# Altium schematic sheet US_SB_MCU.SchDoc
size A2
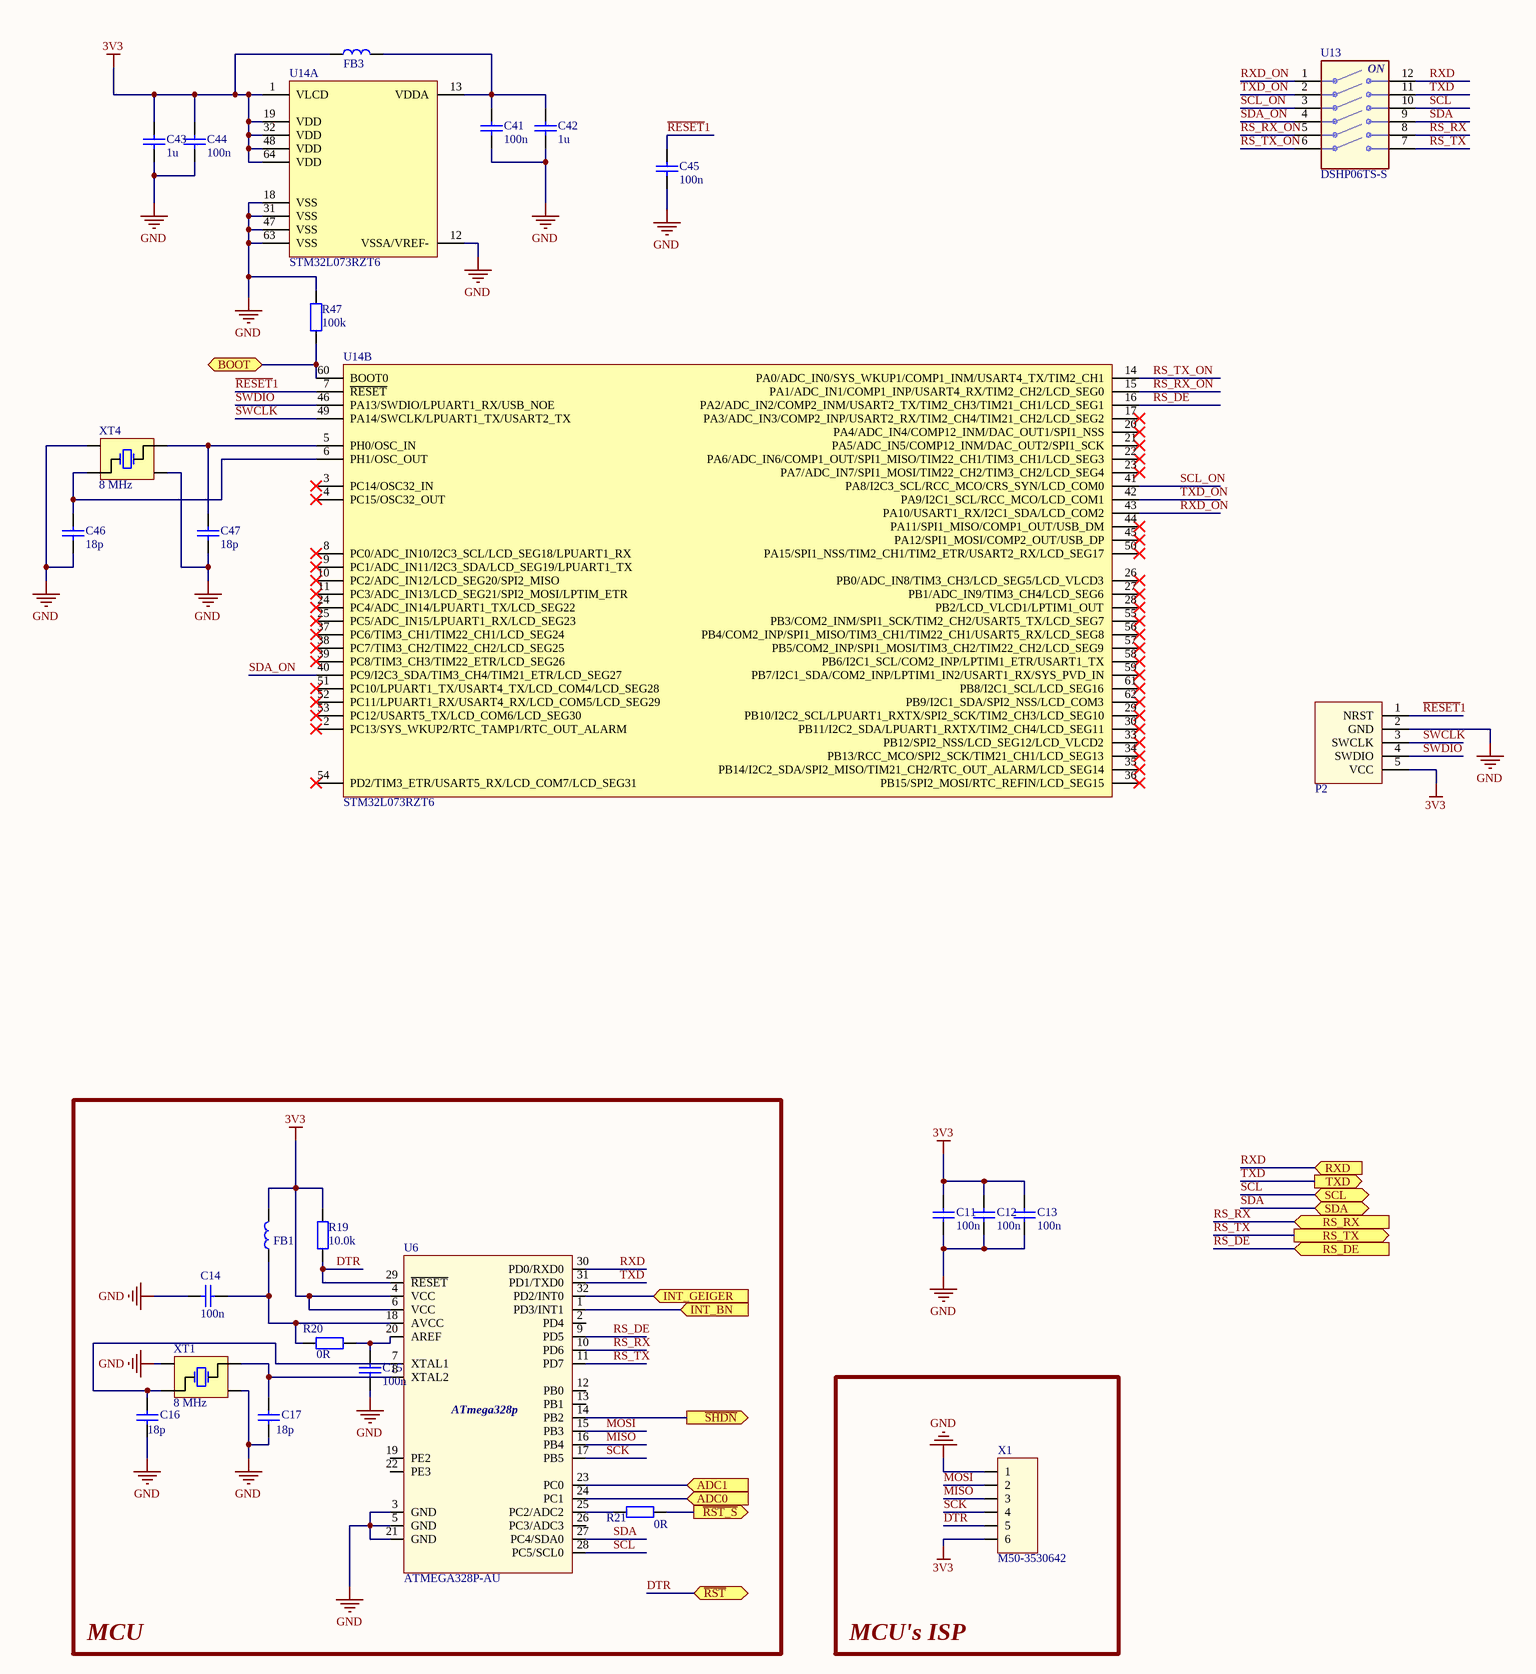
[diagram p0: US_SB_MCU.SchDoc]

## Parts
C11  100n  [C0603_IPC_HD]
C12  100n  [C0603_IPC_HD]
C13  100n  [C0603_IPC_HD]
C14  100n  [C0603_IPC_HD]
C15  100n  [C0603_IPC_HD]
C16  18p  [C0603_IPC_HD]
C17  18p  [C0603_IPC_HD]
C41  100n  [C0603_IPC_HD]
C42  1u  [C0603_IPC_HD]
C43  1u  [C0603_IPC_HD]
C44  100n  [C0603_IPC_HD]
C45  100n  [C0603_IPC_HD]
C46  18p  [C0603_IPC_HD]
C47  18p  [C0603_IPC_HD]
FB1  MH1608-601Y  [L0603_IPC_MD]  (value not drawn)
FB3  MH1608-601Y  [L0603_IPC_MD]  (value not drawn)
P2  SWD  [SWD_CON_VAR1]  (value not drawn)  (no BOM)
R19  10.0k  [R0603_IPC_MD]
R20  0R  [R0603_IPC_MD]
R21  0R  [R0603_IPC_MD]  (no BOM)
R47  100k  [R0603_IPC_MD]
U6  ATMEGA328P-AU  [ATmega328P_TQFP80P900X900X120-32N]
U13  DSHP06TS-S  [SOIC_SW_SOIC127P850X235-12N]
U14  STM32L073RZT6  [LQFP64_10X10MM]  (parts A,B of 2)
X1  M50-3530642  [PLS_1X6_1.27]  (no BOM)
XT1  8 MHz  [5.0X3.2_4PAD_SMT]
XT4  8 MHz  [5.0X3.2_4PAD_SMT]

## Blocks framed on the sheet
MCU: C14-C17 FB1 R19-R21 U6 XT1
MCU's ISP: X1

## Ports
ADC0 (in), ADC1 (in), BOOT, INT_BN (in), INT_GEIGER (in), RS_DE (in), RS_RX (in), RS_TX (out), RXD (in), SCL, SDA, TXD (out), ~{RST_S} (out), ~{RST}, ~{SHDN} (out)

## Nets
3V3: C11.1 C12.1 C13.1 C43.2 C44.2 FB1.2 FB3.1 P2.5(VCC) R19.2 U6.4(VCC) U6.6(VCC) U14.1(VLCD) U14.19(VDD) U14.32(VDD) U14.48(VDD) U14.64(VDD) X1.6
GND: C11.2 C12.2 C13.2 C14.2 C15.2 C16.1 C17.1 C41.1 C42.1 C43.1 C44.1 C45.2 C46.1 C47.1 P2.2(GND) R47.2 U6.3(GND) U6.5(GND) U6.21(GND) U14.12(VSSA/VREF-) U14.18(VSS) U14.31(VSS) U14.47(VSS) U14.63(VSS) X1.1 XT1.2(NC) XT1.4(NC) XT4.2(NC) XT4.4(NC)
~{RESET}1: C45.1 P2.1(NRST) U14.7(~{RESET})
~{RST_S}: R21.2 ; port ~{RST_S}
~{SHDN}: U6.14(PB2) ; port ~{SHDN}
ADC0: U6.24(PC1) ; port ADC0
ADC1: U6.23(PC0) ; port ADC1
BOOT: R47.1 U14.60(BOOT0) ; port BOOT
DTR: R19.1 U6.29(~{RESET}) X1.5 ; port ~{RST}
INT_BN: U6.1(PD3/INT1) ; port INT_BN
INT_GEIGER: U6.32(PD2/INT0) ; port INT_GEIGER
MISO: U6.16(PB4) X1.3
MOSI: U6.15(PB3) X1.2
RS_DE: U6.9(PD5) U14.16(PA2/ADC_IN2/COMP2_INM/USART2_TX/TIM2_CH3/TIM21_CH1/LCD_SEG1) ; port RS_DE
RS_RX: U6.10(PD6) U13.8 ; port RS_RX
RS_RX_ON: U13.5 U14.15(PA1/ADC_IN1/COMP1_INP/USART4_RX/TIM2_CH2/LCD_SEG0)
RS_TX: U6.11(PD7) U13.7 ; port RS_TX
RS_TX_ON: U13.6 U14.14(PA0/ADC_IN0/SYS_WKUP1/COMP1_INM/USART4_TX/TIM2_CH1)
RXD: U6.30(PD0/RXD0) U13.12 ; port RXD
RXD_ON: U13.1 U14.43(PA10/USART1_RX/I2C1_SDA/LCD_COM2)
SCK: U6.17(PB5) X1.4
SCL: U6.28(PC5/SCL0) U13.10 ; port SCL
SCL_ON: U13.3 U14.41(PA8/I2C3_SCL/RCC_MCO/CRS_SYN/LCD_COM0)
SDA: U6.27(PC4/SDA0) U13.9 ; port SDA
SDA_ON: U13.4 U14.40(PC9/I2C3_SDA/TIM3_CH4/TIM21_ETR/LCD_SEG27)
SWCLK: P2.3(SWCLK) U14.49(PA14/SWCLK/LPUART1_TX/USART2_TX)
SWDIO: P2.4(SWDIO) U14.46(PA13/SWDIO/LPUART1_RX/USB_NOE)
TXD: U6.31(PD1/TXD0) U13.11 ; port TXD
TXD_ON: U13.2 U14.42(PA9/I2C1_SCL/RCC_MCO/LCD_COM1)
NetC14_1: C14.1 FB1.1 R20.1 U6.18(AVCC)
NetC15_1: C15.1 R20.2 U6.20(AREF)
NetC16_2: C16.2 U6.7(XTAL1) XT1.3(OSC2)
NetC17_2: C17.2 U6.8(XTAL2) XT1.1(OSC1)
NetC41_2: C41.2 C42.2 FB3.2 U14.13(VDDA)
NetC46_2: C46.2 U14.6(PH1/OSC_OUT) XT4.3(OSC2)
NetC47_2: C47.2 U14.5(PH0/OSC_IN) XT4.1(OSC1)
NetR21_1: R21.1 U6.25(PC2/ADC2)

Not connected (* = marked no-connect by the designer): U6 2(PD4) 12(PB0) 13(PB1) 19(PE2) 22(PE3) 26(PC3/ADC3); U14 2(PC13/SYS_WKUP2/RTC_TAMP1/RTC_OUT_ALARM)* 3(PC14/OSC32_IN)* 4(PC15/OSC32_OUT)* 8(PC0/ADC_IN10/I2C3_SCL/LCD_SEG18/LPUART1_RX)* 9(PC1/ADC_IN11/I2C3_SDA/LCD_SEG19/LPUART1_TX)* 10(PC2/ADC_IN12/LCD_SEG20/SPI2_MISO)* 11(PC3/ADC_IN13/LCD_SEG21/SPI2_MOSI/LPTIM_ETR)* 17(PA3/ADC_IN3/COMP2_INP/USART2_RX/TIM2_CH4/TIM21_CH2/LCD_SEG2)* 20(PA4/ADC_IN4/COMP12_INM/DAC_OUT1/SPI1_NSS)* 21(PA5/ADC_IN5/COMP12_INM/DAC_OUT2/SPI1_SCK)* 22(PA6/ADC_IN6/COMP1_OUT/SPI1_MISO/TIM22_CH1/TIM3_CH1/LCD_SEG3)* 23(PA7/ADC_IN7/SPI1_MOSI/TIM22_CH2/TIM3_CH2/LCD_SEG4)* 24(PC4/ADC_IN14/LPUART1_TX/LCD_SEG22)* 25(PC5/ADC_IN15/LPUART1_RX/LCD_SEG23)* 26(PB0/ADC_IN8/TIM3_CH3/LCD_SEG5/LCD_VLCD3)* 27(PB1/ADC_IN9/TIM3_CH4/LCD_SEG6)* 28(PB2/LCD_VLCD1/LPTIM1_OUT)* 29(PB10/I2C2_SCL/LPUART1_RXTX/SPI2_SCK/TIM2_CH3/LCD_SEG10)* 30(PB11/I2C2_SDA/LPUART1_RXTX/TIM2_CH4/LCD_SEG11)* 33(PB12/SPI2_NSS/LCD_SEG12/LCD_VLCD2)* 34(PB13/RCC_MCO/SPI2_SCK/TIM21_CH1/LCD_SEG13)* 35(PB14/I2C2_SDA/SPI2_MISO/TIM21_CH2/RTC_OUT_ALARM/LCD_SEG14)* 36(PB15/SPI2_MOSI/RTC_REFIN/LCD_SEG15)* 37(PC6/TIM3_CH1/TIM22_CH1/LCD_SEG24)* 38(PC7/TIM3_CH2/TIM22_CH2/LCD_SEG25)* 39(PC8/TIM3_CH3/TIM22_ETR/LCD_SEG26)* 44(PA11/SPI1_MISO/COMP1_OUT/USB_DM)* 45(PA12/SPI1_MOSI/COMP2_OUT/USB_DP)* 50(PA15/SPI1_NSS/TIM2_CH1/TIM2_ETR/USART2_RX/LCD_SEG17)* 51(PC10/LPUART1_TX/USART4_TX/LCD_COM4/LCD_SEG28)* 52(PC11/LPUART1_RX/USART4_RX/LCD_COM5/LCD_SEG29)* 53(PC12/USART5_TX/LCD_COM6/LCD_SEG30)* 54(PD2/TIM3_ETR/USART5_RX/LCD_COM7/LCD_SEG31)* 55(PB3/COM2_INM/SPI1_SCK/TIM2_CH2/USART5_TX/LCD_SEG7)* 56(PB4/COM2_INP/SPI1_MISO/TIM3_CH1/TIM22_CH1/USART5_RX/LCD_SEG8)* 57(PB5/COM2_INP/SPI1_MOSI/TIM3_CH2/TIM22_CH2/LCD_SEG9)* 58(PB6/I2C1_SCL/COM2_INP/LPTIM1_ETR/USART1_TX)* 59(PB7/I2C1_SDA/COM2_INP/LPTIM1_IN2/USART1_RX/SYS_PVD_IN)* 61(PB8/I2C1_SCL/LCD_SEG16)* 62(PB9/I2C1_SDA/SPI2_NSS/LCD_COM3)*

## Notes on the sheet
- (in symbol ATMEGA328P-AU) ATmega328p
- (in symbol DSHP06TS-S) ON

## Library data of the parts
C11-C15 C41 C44 C45 = CL10B104KO8NNNC: CAP CER 0.1UF 16V X7R 0603; Manufacturer: Samsung Electro-Mechanics; Manufacturer Part Number: CL10B104KO8NNNC; Voltage: 16V; Value: 100n; Dielectric: X7R; Supplier 1: Digi-Key; Supplier Part Number 1: 1276-1005-1-ND
C16 C17 C46 C47 = CL10C180JB8NNNC: CAP CER 18PF 50V C0G/NP0 0603; Manufacturer: Samsung Electro-Mechanics; Manufacturer Part Number: CL10C180JB8NNNC; Voltage: 50V; Value: 18p; Dielectric: C0G/NP0; Supplier 1: Digi-Key; Supplier Part Number 1: 1276-1089-1-ND
C42 C43 = CL10B105MO8NNWC: CAP CER 1UF 16V X7R 0603; Manufacturer: Samsung Electro-Mechanics; Manufacturer Part Number: CL10B105MO8NNWC; Voltage: 16V; Value: 1u; Dielectric: X7R; Supplier 1: Digi-Key; Supplier Part Number 1: 1276-6524-1-ND
FB1 FB3 = MH1608-601Y: FERRITE BEAD 600R@100MHz 0603 for Power Line, 1000mA; Manufacturer: Bourns Inc.; Manufacturer Part Number: MH1608-601Y; Supplier 1: Digi-Key; Supplier Part Number 1: MH1608-601YCT-ND
P2 = SWD-CONNECTOR_VAR1: SWDIO SWCLK VDD GND NRST; Manufacturer: *; Manufacturer Part Number: *; Supplier 1: *; Supplier Part Number 1: *
R19 = RMCF0603FT10K0: RES 10K OHM 1% 1/10W 0603; Manufacturer: Stackpole Electronics Inc; Value: 10.0k; Tolarance: 1%; Manufacturer Part Number: RMCF0603FT10K0; Supplier 1: Digi-Key; Supplier Part Number 1: RMCF0603FT10K0CT-ND
R20 R21 = CR0603-J/-000ELF: RES SMD 0 OHM JUMPER 1/10W 0603; Manufacturer: Bourns Inc.; Tolarance: 1%; Value: 0R; Manufacturer Part Number: CR0603-J/-000ELF; Supplier 1: Digi-Key; Supplier Part Number 1: CR0603-J/-000ELFCT-ND
R47 = CR0603-JW-104ELF: RES SMD 100K OHM 5% 1/10W 0603; Manufacturer: Bourns Inc.; Value: 100k; Tolarance: 5%; Manufacturer Part Number: CR0603-JW-104ELF; Supplier 1: Digi-Key; Supplier Part Number 1: CR0603-JW-104ELFCT-ND
U6 = ATMEGA328P-AU: AVR AVR® ATmega Microcontroller IC 8-Bit 20MHz 32KB (16K x 16) FLASH 32-TQFP (7x7); Manufacturer: Microchip Technology; SRAM: 2K x 8; Manufacturer Part Number: ATMEGA328P-AU; FLASH: 32KB (16K x 16); Supplier 1: Digi-Key; Supplier Part Number 1: ATMEGA328P-AU-ND
U13 = DSHP06TS-S: SPST 6 1.27mm, Half Slide (Standard) Black SMD DIP Switches RoHS; Manufacturer: XKB Enterprise; Manufacturer Part Number: DSHP06TS-S; Supplier 1: lcsc.com; Supplier Part Number 1: C319048
U14 = STM32L073RZT6: Ultra-low-power 32-bit MCU ARM®-based Cortex®-M0+; Manufacturer: ST; SRAM: 20KB; FLASH: 192KB; Manufacturer Part Number: STM32L073RZT6; Supplier 1: Digi-Key; Supplier Part Number 1: 497-16270-ND
X1 = PLD_1X6_1.27: CONN HEADER VERT 6POS 1.27MM; Manufacturer: Harwin Inc.; Number of Positions: 6; Manufacturer Part Number: M50-3530642; Supplier 1: Digi-Key; Supplier Part Number 1: 952-3602-ND
XT1 XT4 = ABM3B-8.000MHZ-10-1-U-T: 8MHz ±10ppm Crystal 10pF 200 Ohms 4-SMD, No Lead; Manufacturer: Abracon LLC; Manufacturer Part Number: ABM3B-8.000MHZ-10-1-U-T; Type: XTAL; Value: 8 MHz